# EAGLE schematic Sensor Board (EAGLE 9.5.1)
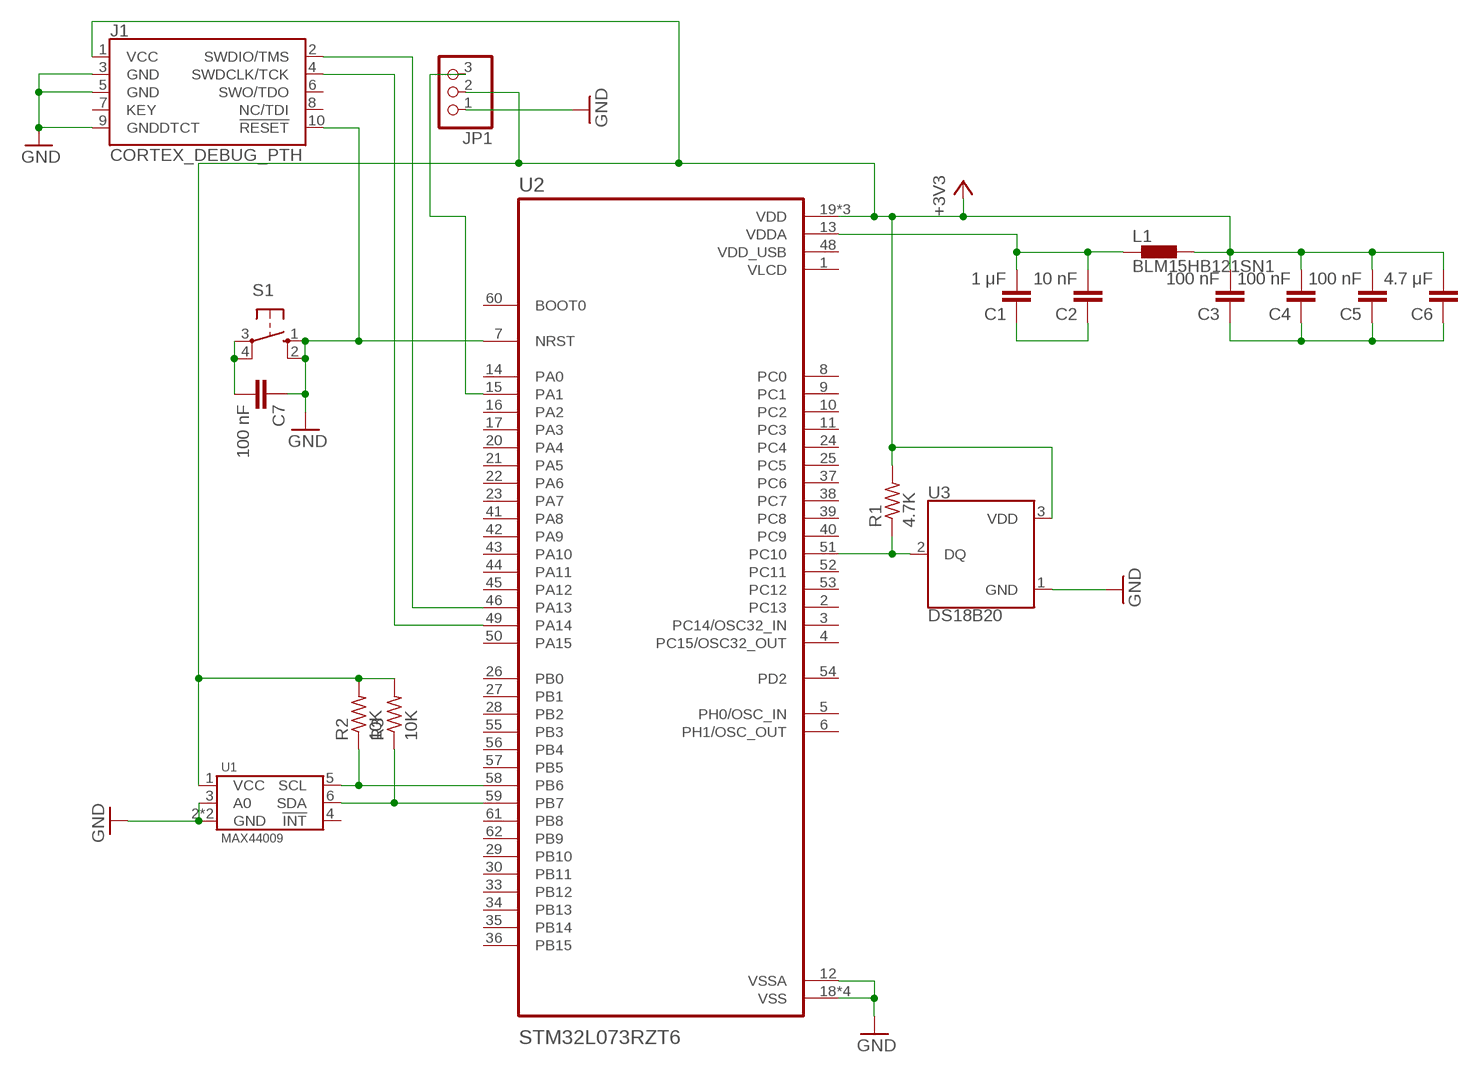
[diagram p0: schematic, sheet 1]

## Parts
C1  1 μF  C2,5-3  [C2.5-3]
C2  10 nF  C2,5-3  [C2.5-3]
C3  100 nF  C2,5-3  [C2.5-3]
C4  100 nF  C2,5-3  [C2.5-3]
C5  100 nF  C2,5-3  [C2.5-3]
C6  4.7 μF  C2,5-3  [C2.5-3]
C7  100 nF  C2,5-3  [C2.5-3]
J1  CORTEX_DEBUG_PTH  [2X5-PTH-1.27MM]
JP1  PINHD-1X3  [1X03]
L1  BLM15HB121SN1  [0402]
R1  4.7K  R-US_0204/5  [0204/5]
R2  10K  R-US_0204/5  [0204/5]
R3  10K  R-US_0204/5  [0204/5]
S1  10-XX  [B3F-10XX]
U1  MAX44009  [MAX44009]
U2  STM32L073RZT6  [QFP50P1200X1200X160-64N]
U3  DS18B20  [TO-92-TO92127P495H2044-3]

## Nets
+3V3: C3.2 C4.2 C5.2 C6.2 J1.1(VCC) JP1.2 L1.2 R1.2 R2.2 R3.2 U1.1(VCC) U2.19(VDD) U2.32(VDD) U2.64(VDD) U3.3(VDD)
GND: C7.1 J1.3(GND) J1.5(GND) J1.9(GNDDTCT) J1.10(!RESET) JP1.1 S1.1(S) S1.2(S1) U1.2(GND) U1.3(A0) U1.PAD(GND) U2.7(NRST) U2.12(VSSA) U2.18(VSS) U2.31(VSS) U2.47(VSS) U2.63(VSS) U3.1(GND)
N$1: C1.2 C2.2 L1.1 U2.13(VDDA)
N$2: R2.1 U1.5(SCL) U2.58(PB6)
N$3: R3.1 U1.6(SDA) U2.59(PB7)
N$4: C1.1 C2.1
N$5: JP1.3 U2.15(PA1)
N$6: J1.2(SWDIO/TMS) U2.46(PA13)
N$7: R1.1 U2.51(PC10) U3.2(DQ)
N$8: C3.1 C4.1 C5.1 C6.1
N$9: C7.2 S1.3(P) S1.4(P1)
N$11: J1.4(SWDCLK/TCK) U2.49(PA14)
Unconnected: J1.6(SWO/TDO) J1.7(KEY) J1.8(NC/TDI) U1.4(!INT) U2.2(PC13) U2.3(PC14/OSC32_IN) U2.4(PC15/OSC32_OUT) U2.5(PH0/OSC_IN) U2.6(PH1/OSC_OUT) U2.8(PC0) U2.9(PC1) U2.10(PC2) U2.11(PC3) U2.14(PA0) U2.16(PA2) U2.17(PA3) U2.20(PA4) U2.21(PA5) U2.22(PA6) U2.23(PA7) U2.24(PC4) U2.25(PC5) U2.26(PB0) U2.27(PB1) U2.28(PB2) U2.29(PB10) U2.30(PB11) U2.33(PB12) U2.34(PB13) U2.35(PB14) U2.36(PB15) U2.37(PC6) U2.38(PC7) U2.39(PC8) U2.40(PC9) U2.41(PA8) U2.42(PA9) U2.43(PA10) U2.44(PA11) U2.45(PA12) U2.50(PA15) U2.52(PC11) U2.53(PC12) U2.54(PD2) U2.55(PB3) U2.56(PB4) U2.57(PB5) U2.60(BOOT0) U2.61(PB8) U2.62(PB9)

## Power pins joined to a net without a drawn wire
VDD_USB: U2.48(VDD_USB)
VLCD: U2.1(VLCD)

## Library data of the parts
C1-C7 = capacitor-wima:C: CAPACITOR naming: grid - package width
J1 = SparkFun-Connectors:CORTEX_DEBUG: Cortex Debug Connector - 10 pin Supports JTAG debug, Serial Wire debug, and Serial Wire Viewer. PTH and SMD connector options available. General Connector Information <http://infocenter.arm.com/help/topic/com.arm.doc.faqs/attached/13634/cortex_debug_connectors.pdf> Products: PTH Connector <http://www.digikey.com/product-detail/en/cnc-tech/3220-10-0100-00/1175-1627-ND/3883661> -via Digi-Key SparkFun PSoc <https://www.sparkfun.com/products/13229> SparkFun T <https://www.sparkfun.com/products/13810>
JP1 = pinhead:PINHD-1X3: PIN HEADER
L1 = inductors:BLM15H: EMIFIL (R) Chip Ferrite Bead for GHz Noise Source: http://www.murata.com/ Ferrite Bead BLM15H.pdf
R1-R3 = rcl:R-US_: RESISTOR, American symbol; SPICEPREFIX: R
S1 = switch-omron:10-XX: OMRON SWITCH; MPN: B3F-1000; OC_FARNELL: 176432; OC_NEWARK: 36M3542
U1 = Maxim:MAX44009: Ambient Light Sensor
U2 = STM32L073RZT6:STM32L073RZT6: None; AVAILABILITY: Unavailable; DESCRIPTION: Ultra-low-power ARM Cortex-M0+ MCU with 192 Kbytes Flash, 32 MHz CPU, USB, LCD; MF: STMicroelectronics; MP: STM32L073RZT6; PACKAGE: LQFP-64 STMicroelectronics; PRICE: None
U3 = DS18B20:DS18B20: digital thermometer -55C-125C TO92-3; AVAILABILITY: Unavailable; DESCRIPTION: SENSOR DIGITAL -55C-125C TO92-3; MF: Maxim Integrated; MP: DS18B20; PACKAGE: TO-92 Maxim Integrated; PRICE: None